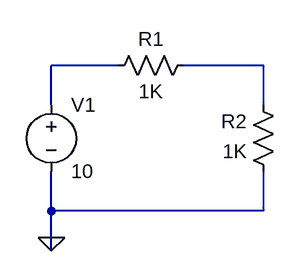
[diagram p0: schematic Assignment-1.2.asc]
Assignment-1.2.asc, the LTspice schematic file:
Version 4
SHEET 1 880 680
WIRE 352 256 272 256
WIRE 528 256 432 256
WIRE 272 304 272 256
WIRE 528 304 528 256
WIRE 272 432 272 384
WIRE 528 432 528 384
WIRE 528 432 272 432
WIRE 272 464 272 432
WIRE 272 480 272 464
FLAG 272 464 0
SYMBOL voltage 272 288 R0
SYMATTR InstName V1
SYMATTR Value 10
SYMBOL res 448 240 R90
WINDOW 0 0 56 VBottom 2
WINDOW 3 32 56 VTop 2
SYMATTR InstName R1
SYMATTR Value 1K
SYMBOL res 544 400 R180
WINDOW 0 36 76 Left 2
WINDOW 3 36 40 Left 2
SYMATTR InstName R2
SYMATTR Value 1K

The netlist it stands for:
* Assignment-1.2.asc
V1 N001 0 10
R1 N002 N001 1K
R2 0 N002 1K
.backanno
.end